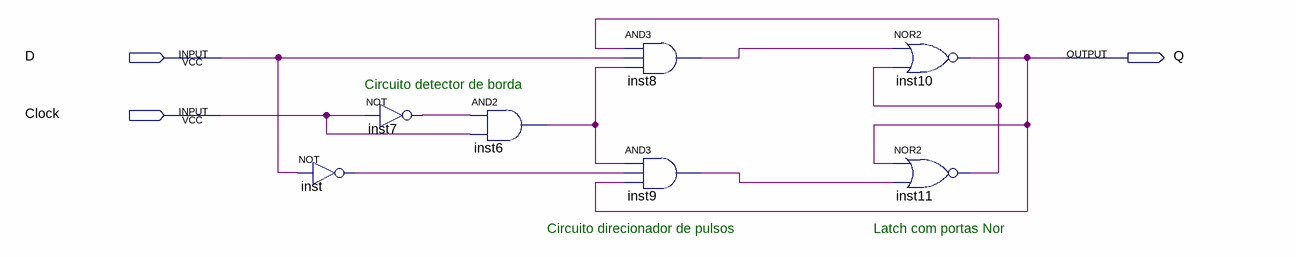
[diagram p0: schematic sheet]
// Quartus schematic Flip-flop_D.bdf as structural Verilog: 7 symbols, 3 pins
module \Flip-flop_D  (
  input  D,
  input  Clock,
  output Q
);

  wire inst6_out, inst7_out, inst8_out, inst9_out, inst11_out, inst_out;

  not inst (inst_out, D);
  not inst7 (inst7_out, Clock);
  and inst6 (inst6_out, inst7_out, Clock);
  and inst8 (inst8_out, inst11_out, D, inst6_out);
  and inst9 (inst9_out, inst6_out, inst_out, Q);
  nor inst10 (Q, inst8_out, inst11_out);
  nor inst11 (inst11_out, Q, inst9_out);

  // Notes on the sheet:
  //   Circuito detector de borda
  //   Circuito direcionador de pulsos
  //   Latch com portas Nor
endmodule
